# EAGLE schematic BATT_FLEX12 (EAGLE 9.6.2)
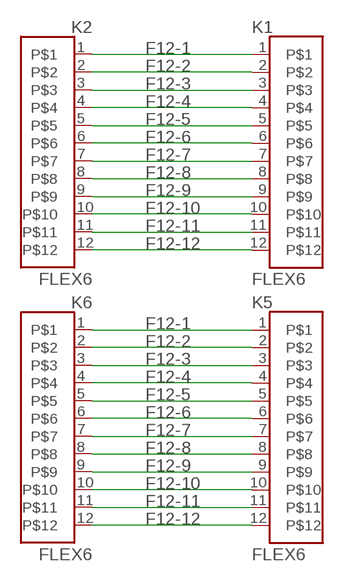
[diagram p0: schematic, sheet 1]

## Parts
K1  FLEX6  [FLEX6]
K2  FLEX6  [FLEX6]
K5  FLEX6  [FLEX6]
K6  FLEX6  [FLEX6]

## Nets
F12-1: K1.1 K2.1 K5.1 K6.1
F12-2: K1.2 K2.2 K5.2 K6.2
F12-3: K1.3 K2.3 K5.3 K6.3
F12-4: K1.4 K2.4 K5.4 K6.4
F12-5: K1.5 K2.5 K5.5 K6.5
F12-6: K1.6 K2.6 K5.6 K6.6
F12-7: K1.7 K2.7 K5.7 K6.7
F12-8: K1.8 K2.8 K5.8 K6.8
F12-9: K1.9 K2.9 K5.9 K6.9
F12-10: K1.10 K2.10 K5.10 K6.10
F12-11: K1.11 K2.11 K5.11 K6.11
F12-12: K1.12 K2.12 K5.12 K6.12

## Library data of the parts
K1 K2 K5 K6 = Flex:FLEX6: WR-FPC 1mm SMT Horiz. Bot. Contact Hinge type WR-FPC 1mm 06 pins Hinge type SMT Horizontal Bottom Contact ;=>Code : Con_FPC_ZIF_1.00_6861xx148922_686106148922 <http://katalog.we-online.de/media/images/eican/Con_FPC_ZIF_1.00_686110148922_pf2.jpg> Details see: http://katalog.we-online.de/em/datasheet/6861xx148922.pdf Created 2014-10-08, Karrer Zheng 2014 (C) Wurth Elektronik